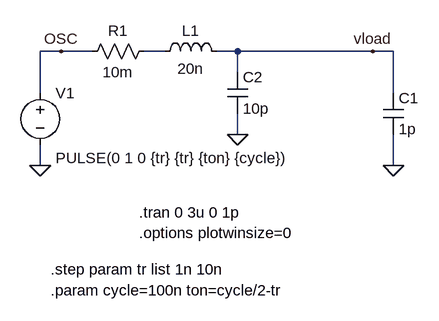
[diagram p0: schematic resonance_02_rising_time.asc]
resonance_02_rising_time.asc, the LTspice schematic file:
Version 4
SHEET 1 880 680
WIRE 32 80 0 80
WIRE 80 80 32 80
WIRE 192 80 160 80
WIRE 304 80 272 80
WIRE 512 80 304 80
WIRE 544 80 512 80
WIRE 304 112 304 80
WIRE 0 144 0 80
WIRE 544 144 544 80
WIRE 304 208 304 176
WIRE 0 256 0 224
WIRE 544 256 544 208
FLAG 0 256 0
FLAG 544 256 0
FLAG 32 80 OSC
FLAG 512 80 vload
FLAG 304 208 0
SYMBOL voltage 0 128 R0
WINDOW 123 0 0 Left 0
WINDOW 39 0 0 Left 0
WINDOW 3 24 116 Left 2
SYMATTR Value PULSE(0 1 0 {tr} {tr} {ton} {cycle})
SYMATTR InstName V1
SYMBOL cap 528 144 R0
SYMATTR InstName C1
SYMATTR Value 1p
SYMBOL ind 176 96 R270
WINDOW 0 32 56 VTop 2
WINDOW 3 5 56 VBottom 2
SYMATTR InstName L1
SYMATTR Value 20n
SYMBOL res 64 96 R270
WINDOW 0 32 56 VTop 2
WINDOW 3 0 56 VBottom 2
SYMATTR InstName R1
SYMATTR Value 10m
SYMBOL cap 288 112 R0
SYMATTR InstName C2
SYMATTR Value 10p
TEXT 152 360 Left 2 !.options plotwinsize=0
TEXT 152 328 Left 2 !.tran 0 3u 0 1p
TEXT 16 416 Left 2 !.step param tr list 1n 10n
TEXT 16 448 Left 2 !.param cycle=100n ton=cycle/2-tr

The netlist it stands for:
* resonance_02_rising_time.asc
V1 OSC 0 PULSE(0 1 0 {tr} {tr} {ton} {cycle})
C1 vload 0 1p
L1 N001 vload 20n
R1 OSC N001 10m
C2 vload 0 10p
.options plotwinsize=0
.tran 0 3u 0 1p
.step param tr list 1n 10n
.param cycle=100n ton=cycle/2-tr
.backanno
.end